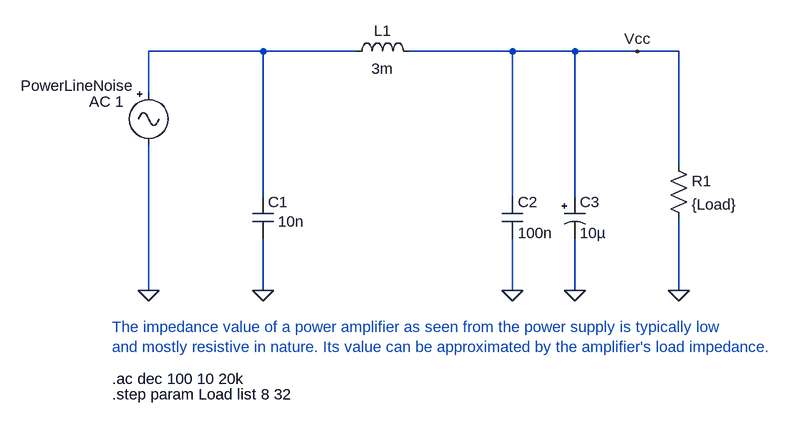
[diagram p0: schematic EMCFilter LTSpice.asc]
EMCFilter LTSpice.asc, the LTspice schematic file:
Version 4
SHEET 1 920 680
WIRE -640 -1424 -816 -1424
WIRE -496 -1424 -640 -1424
WIRE -256 -1424 -416 -1424
WIRE -160 -1424 -256 -1424
WIRE -64 -1424 -160 -1424
WIRE 0 -1424 -64 -1424
WIRE -816 -1360 -816 -1424
WIRE 0 -1248 0 -1424
WIRE -640 -1200 -640 -1424
WIRE -256 -1200 -256 -1424
WIRE -160 -1200 -160 -1424
WIRE -816 -1056 -816 -1280
WIRE -640 -1056 -640 -1136
WIRE -256 -1056 -256 -1136
WIRE -160 -1056 -160 -1136
WIRE 0 -1056 0 -1168
FLAG -640 -1056 0
FLAG -816 -1056 0
FLAG -256 -1056 0
FLAG -160 -1056 0
FLAG 0 -1056 0
FLAG -64 -1424 Vcc
SYMBOL cap -656 -1200 R0
WINDOW 3 39 38 Left 2
SYMATTR Value 10n
SYMATTR InstName C1
SYMBOL Misc\\signal -816 -1376 R0
WINDOW 123 -92 29 Left 2
WINDOW 39 0 0 Left 0
WINDOW 0 -197 5 Left 2
SYMATTR Value2 AC 1
SYMATTR InstName PowerLineNoise
SYMATTR Value ""
SYMBOL ind -512 -1408 R270
WINDOW 0 32 56 VTop 2
WINDOW 3 5 56 VBottom 2
SYMATTR InstName L1
SYMATTR Value 3m
SYMBOL cap -272 -1200 R0
SYMATTR InstName C2
SYMATTR Value 100n
SYMBOL polcap -176 -1200 R0
SYMATTR InstName C3
SYMATTR Value 10µ
SYMBOL res -16 -1264 R0
SYMATTR InstName R1
SYMATTR Value {Load}
TEXT -872 -920 Left 2 !.ac dec 100 10 20k
TEXT -872 -896 Left 2 !.step param Load list 8 32
TEXT -872 -1000 Left 2 ;The impedance value of a power amplifier as seen from the power supply is typically low\nand mostly resistive in nature. Its value can be approximated by the amplifier's load impedance.

The netlist it stands for:
* EMCFilter LTSpice.asc
C1 N001 0 10n
V§PowerLineNoise N001 0 AC 1
L1 N001 Vcc 3m
C2 Vcc 0 100n
C3 Vcc 0 10µ
R1 Vcc 0 {Load}
.ac dec 100 10 20k
.step param Load list 8 32
* The impedance value of a power amplifier as seen from the power supply is typically low
* and mostly resistive in nature. Its value can be approximated by the amplifier's load impedance.
.backanno
.end